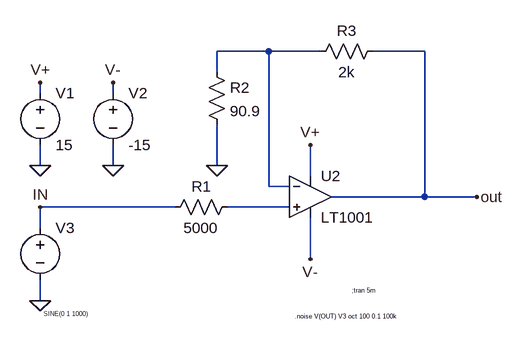
[diagram p0: schematic non_inverting_op_amp_noise_LT1001.asc]
non_inverting_op_amp_noise_LT1001.asc, the LTspice schematic file:
Version 4
SHEET 1 880 680
WIRE 192 80 112 80
WIRE 272 80 192 80
WIRE 432 80 352 80
WIRE 112 112 112 80
WIRE -160 144 -160 128
WIRE -48 144 -48 128
WIRE -160 256 -160 224
WIRE -48 256 -48 224
WIRE 112 256 112 192
WIRE 256 272 256 224
WIRE 192 288 192 80
WIRE 224 288 192 288
WIRE 432 304 432 80
WIRE 432 304 288 304
WIRE 512 304 432 304
WIRE 48 320 -160 320
WIRE 224 320 128 320
WIRE -160 352 -160 320
WIRE 256 400 256 336
WIRE -160 464 -160 432
FLAG -160 256 0
FLAG -48 256 0
FLAG -160 464 0
FLAG -160 320 IN
FLAG 256 400 V-
FLAG -48 128 V-
FLAG -160 128 V+
FLAG 256 224 V+
FLAG 512 304 out
FLAG 112 256 0
SYMBOL voltage -160 128 R0
WINDOW 123 0 0 Left 0
WINDOW 39 0 0 Left 0
SYMATTR InstName V1
SYMATTR Value 15
SYMBOL voltage -48 128 R0
WINDOW 123 0 0 Left 0
WINDOW 39 0 0 Left 0
SYMATTR InstName V2
SYMATTR Value -15
SYMBOL voltage -160 336 R0
WINDOW 123 0 0 Left 0
WINDOW 39 0 0 Left 0
WINDOW 3 5 148 Left 0
SYMATTR Value SINE(0 1 1000)
SYMATTR InstName V3
SYMBOL OpAmps\\LT1001 256 240 R0
SYMATTR InstName U2
SYMBOL res 144 304 R90
WINDOW 0 0 56 VBottom 2
WINDOW 3 32 56 VTop 2
SYMATTR InstName R1
SYMATTR Value 5000
SYMBOL res 96 96 R0
SYMATTR InstName R2
SYMATTR Value 90.9
SYMBOL res 368 64 R90
WINDOW 0 0 56 VBottom 2
WINDOW 3 32 56 VTop 2
SYMATTR InstName R3
SYMATTR Value 2k
TEXT 320 448 Left 0 !;tran 5m
TEXT 232 488 Left 0 !.noise V(OUT) V3 oct 100 0.1 100k

The netlist it stands for:
* non_inverting_op_amp_noise_LT1001.asc
V1 V+ 0 15
V2 V- 0 -15
V3 IN 0 SINE(0 1 1000)
XU2 N002 N001 V+ V- out LT1001  ; pins In+ In- V+ V- OUT
R1 N002 IN 5000
R2 N001 0 90.9
R3 out N001 2k
;tran 5m
.noise V(OUT) V3 oct 100 0.1 100k
.lib LTC.lib
.backanno
.end